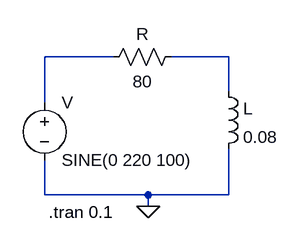
[diagram p0: schematic Draft1.asc]
Draft1.asc, the LTspice schematic file:
Version 4
SHEET 1 880 680
WIRE 144 80 48 80
WIRE 304 80 224 80
WIRE 304 128 304 80
WIRE 48 144 48 80
WIRE 48 272 48 224
WIRE 192 272 48 272
WIRE 304 272 304 208
WIRE 304 272 192 272
WIRE 192 288 192 272
FLAG 192 288 0
SYMBOL voltage 48 128 R0
WINDOW 123 0 0 Left 0
WINDOW 39 0 0 Left 0
SYMATTR InstName V
SYMATTR Value SINE(0 220 100)
SYMBOL res 128 96 R270
WINDOW 0 32 56 VTop 2
WINDOW 3 -3 56 VBottom 2
SYMATTR InstName R
SYMATTR Value 80
SYMBOL ind 288 112 R0
SYMATTR InstName L
SYMATTR Value 0.08
TEXT 54 296 Left 2 !.tran 0.1

The netlist it stands for:
* Draft1.asc
V N001 0 SINE(0 220 100)
R N001 N002 80
L N002 0 0.08
.tran 0.1
.backanno
.end